# EAGLE design vca-op1 (EAGLE 6.6.0)
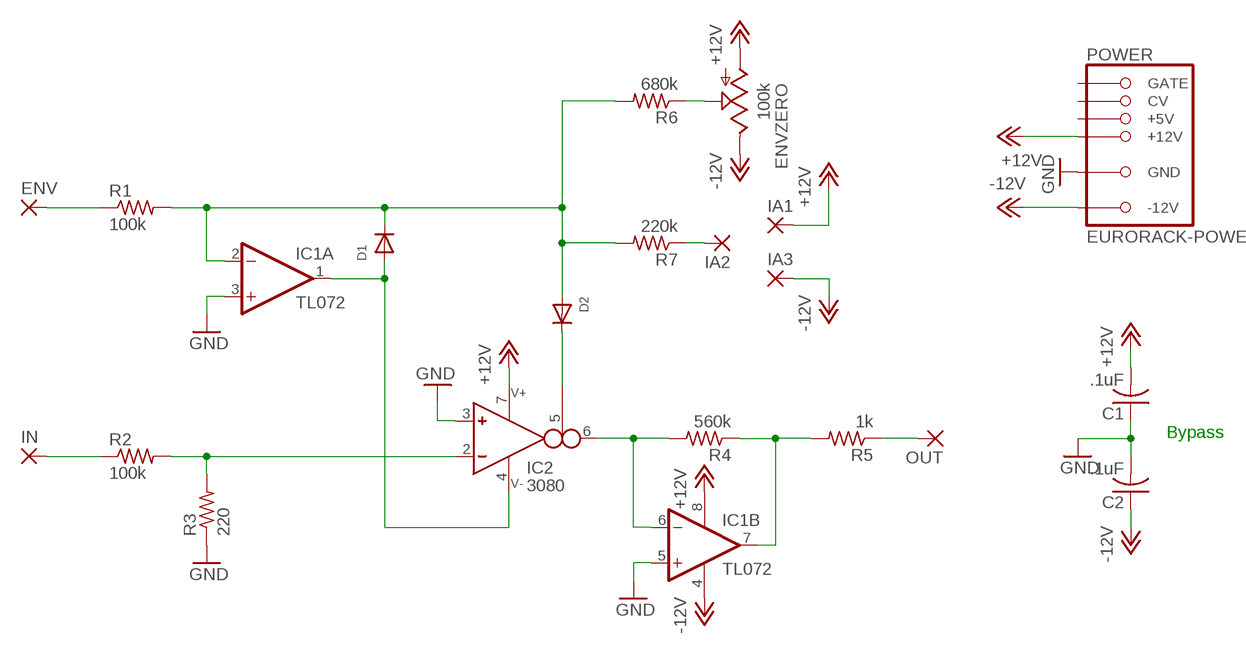
[diagram p0: schematic, sheet 1]

## Parts
C1  .1uF  C-US050-025X075  [C050-025X075]
C2  .1uF  C-US050-025X075  [C050-025X075]
D1  DIODEDO-1N4148  [DO-1N4148]
D2  DIODEDO-1N4148  [DO-1N4148]
ENV  2,54/1,0  [2,54/1,0]
ENVZERO  100k  TRIM_US-RJ9W  [RJ9W]
IA1  2,54/1,0  [2,54/1,0]
IA2  2,54/1,0  [2,54/1,0]
IA3  2,54/1,0  [2,54/1,0]
IC1  TL072  TL072-TOPP  [DIL08]
IC2  3080  CA3080E  [DIL08]
IN  2,54/1,0  [2,54/1,0]
OUT  2,54/1,0  [2,54/1,0]
POWER  EURORACK-POWER  [PINSHRD_PTH_2X8]
R1  100k  R-US_0207/10  [0207/10]
R2  100k  R-US_0207/10  [0207/10]
R3  220  R-US_0207/10  [0207/10]
R4  560k  R-US_0207/10  [0207/10]
R5  1k  R-US_0207/10  [0207/10]
R6  680k  R-US_0207/10  [0207/10]
R7  220k  R-US_0207/10  [0207/10]

## Nets
+12V: C1.2 ENVZERO.A IA1.1(P) IC1.8(P:V+) IC2.7(V+) POWER.+12V@1(+12V) POWER.+12V@2(+12V)
-12V: C2.1 ENVZERO.E IA3.1(P) IC1.4(P:V-) POWER.-12V@1(-12V) POWER.-12V@2(-12V)
GND: C1.1 C2.2 IC1.3(A:+IN) IC1.5(B:+IN) IC2.3(IN_P) POWER.GND@1(GND) POWER.GND@2(GND) POWER.GND@3(GND) POWER.GND@4(GND) POWER.GND@5(GND) POWER.GND@6(GND) R3.1
N$1: D1.C D2.A IC1.2(A:-IN) R1.2 R6.2 R7.2
N$2: ENV.1(P) R1.1
N$3: D2.C IC2.5(I_BIAS)
N$4: IN.1(P) R2.1
N$5: IC2.2(IN_N) R2.2 R3.2
N$6: ENVZERO.S R6.1
N$7: IC1.6(B:-IN) IC2.6(OUT) R4.2
N$8: IC1.7(B:OUT) R4.1 R5.2
N$9: OUT.1(P) R5.1
N$10: IA2.1(P) R7.1
V-: D1.A IC1.1(A:OUT) IC2.4(V-)
Unconnected: POWER.+5V@1(+5V) POWER.+5V@2(+5V) POWER.CV@1(CV) POWER.CV@2(CV) POWER.GATE@1(GATE) POWER.GATE@2(GATE)

## Notes on the sheet
- Bypass

## Library data of the parts
C1 C2 = rcl:C-US: CAPACITOR, American symbol
D1 D2 = mmoretti:DIODE: Diode SMADIODE - SMA Surface Mount Package 20V 1A Schottky Diode Digikey: 641-1014-6-ND DO-1N4148 - Through Hole Small Current Diode SOD-123 20V 1 A (.5mV Vf) Schottky Diode - Digikey: MBRX120TPMSCT-ND SOD-323 10V 570mA (.38mV Vf, 3ns) Schottky Diode - Digikey: ZLLS410CT-ND SOD-523 30V 30mA Schottky Diode (RB751S-40TE61) - Digikey: RB751S-40TE61CT-ND SOT23-R/W - SOT23 Package (R = Solder Paste/Reflow Ovens, W = Hand-Soldering) BAT54Film 40V 300mA - Digikey: 497-7162-1-ND
ENV IA1-IA3 IN OUT = wirepad:2,54/1,0: THROUGH-HOLE PAD
ENVZERO = pot:TRIM_US-: POTENTIOMETER
IC1 = mmoretti:TL072-TOP: OP AMP
IC2 = ota:CA3080: OTA
POWER = mmoretti:EURORACK-POWER
R1-R7 = rcl:R-US_: RESISTOR, American symbol

## Board
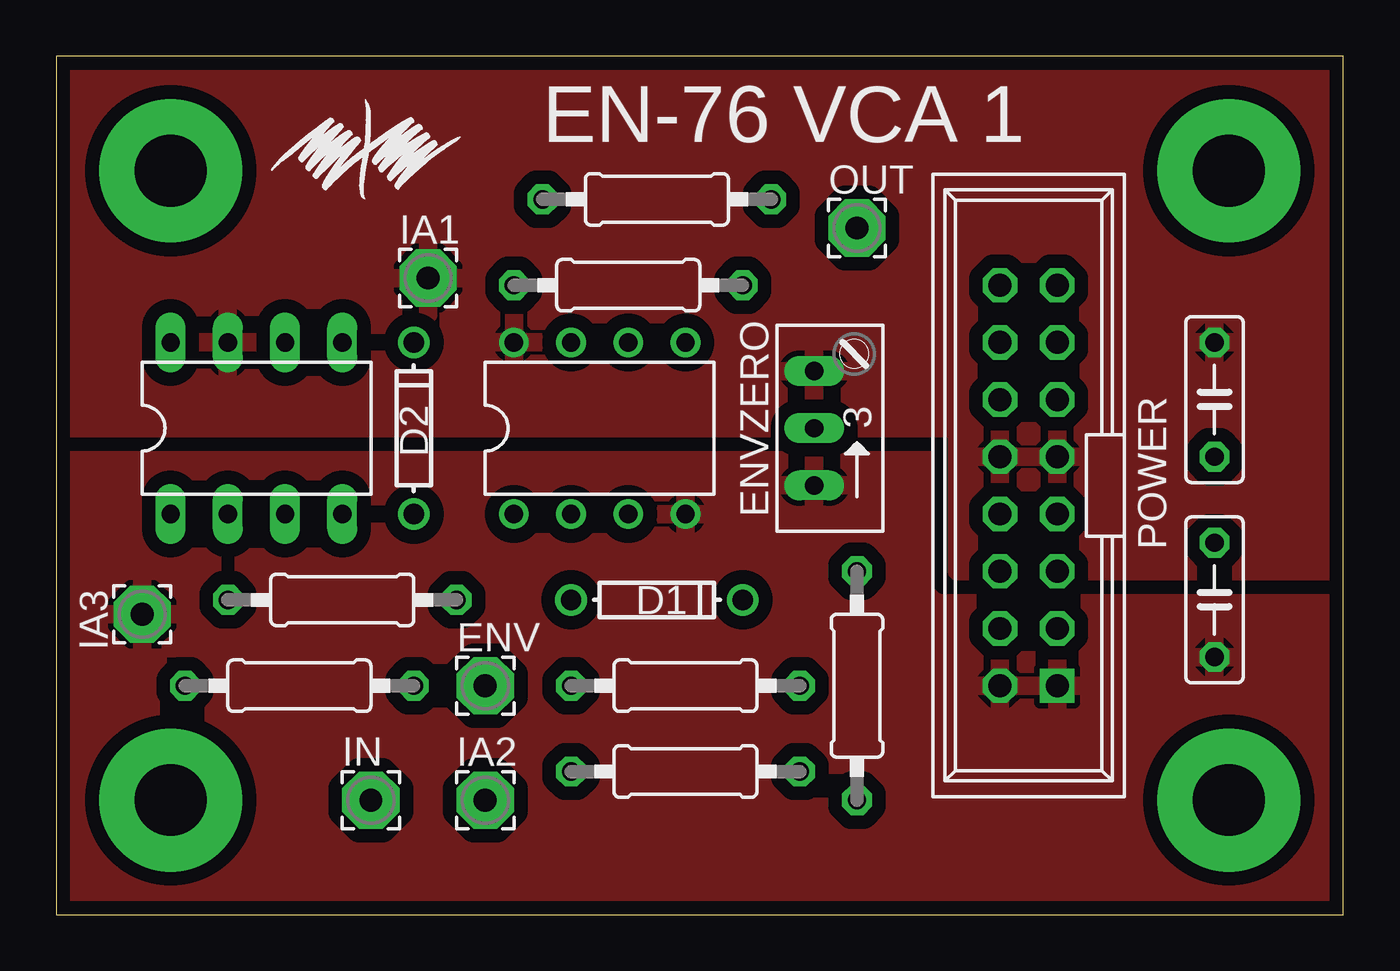
[diagram p1: board, top side]
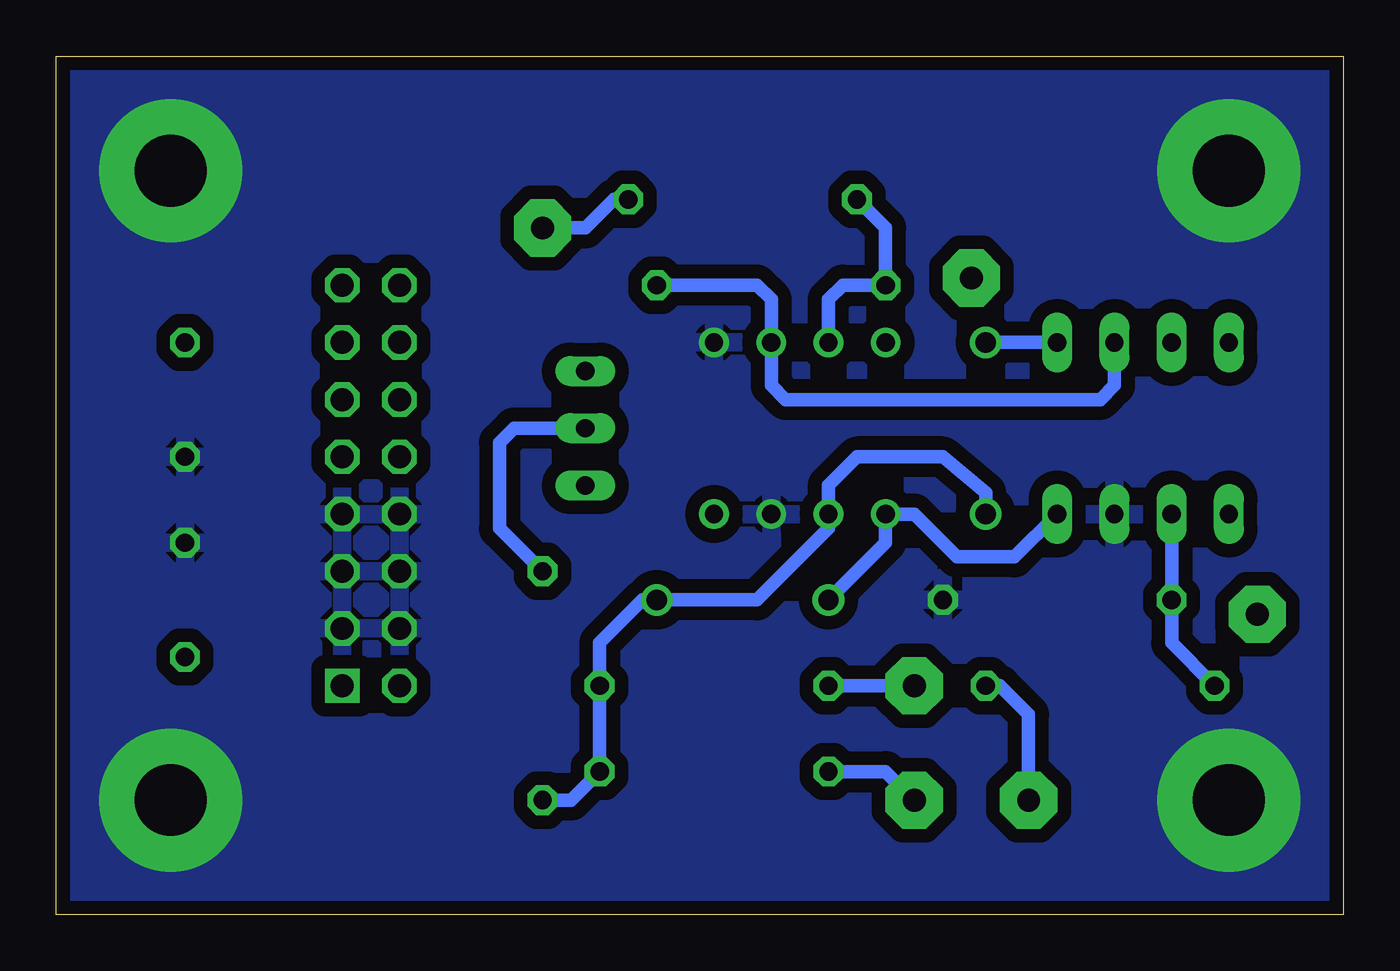
[diagram p2: board, bottom side, seen from below]

Size 57.15 x 38.1 mm. Coordinates in mm from the lower left corner, seen from the top.
Outline: 0,0 57.15,0 57.15,38.1 0,38.1 0,0
Copper layers (1*16): Top 0.035mm / dielectric 1.5mm / Bottom 0.035mm
Design rules "SeeedStudio_2layer_DRU_no_angle_20140221": minimum track width 6mil, minimum drill 12mil, track to track 6mil, track to pad 6mil, pad to pad 6mil, via to via 6mil, smd to smd 0mil, copper to edge 10mil, drill to drill 10mil, minimum pad ring 10mil, minimum via ring 6mil, stop-mask expansion 2mil, vias tented up to drill 100mil, thermal gap 10mil

### Footprints (pad centres in the part's own frame; a part is rotated, then mirrored left to right if it is on the bottom)
C050-025X075 = drill 0.813 octagon: 1 -2.54,0; 2 2.54,0
DO-1N4148 = drill 0.9: A -3.81,0; C 3.81,0
2,54/1,0 = drill 1.016 pad 2.54 octagon: 1 0,0
RJ9W = drill 0.813 long: A 2.54,0.635; E -2.54,0.635; S 0,0.635
DIL08 = drill 0.813 pad 1.27: 1 -3.81,-3.81; 2 -1.27,-3.81; 3 1.27,-3.81; 4 3.81,-3.81; 5 3.81,3.81; 6 1.27,3.81; 7 -1.27,3.81; 8 -3.81,3.81
DIL08' = drill 0.813 long: 1 -3.81,-3.81; 2 -1.27,-3.81; 3 1.27,-3.81; 4 3.81,-3.81; 5 3.81,3.81; 6 1.27,3.81; 7 -1.27,3.81; 8 -3.81,3.81
PINSHRD_PTH_2X8 = drill 1.016 octagon: +5V@1 3.81,1.27; +5V@2 3.81,-1.27; +12V@1 1.27,1.27; +12V@2 1.27,-1.27; -12V@1 -8.89,1.27; CV@1 6.35,1.27; CV@2 6.35,-1.27; GATE@1 8.89,1.27; GATE@2 8.89,-1.27; GND@1 -6.35,1.27; GND@2 -6.35,-1.27; GND@3 -3.81,1.27; GND@4 -3.81,-1.27; GND@5 -1.27,1.27; GND@6 -1.27,-1.27 | drill 1.016 square: -12V@2 -8.89,-1.27
0207/10 = drill 0.813 octagon: 1 -5.08,0; 2 5.08,0

### Placement (x,y rotation side)
C1  51.44,22.86 90 top
C2  51.44,13.97 90 top
D1  26.67,13.97 0 top
D2  15.88,21.59 90 top
ENV  19.05,10.16 0 top
ENVZERO  34.29,21.59 90 top
IA1  16.51,28.26 0 top
IA2  19.05,5.08 0 top
IA3  3.81,13.34 0 top
IC1  24.13,21.59 0 top
IC2  3080  [DIL08']  8.89,21.59 0 top
IN  13.97,5.08 0 top
OUT  35.56,30.48 0 top
POWER  43.18,19.05 90 top
R1  27.94,10.16 0 top
R2  10.79,10.16 180 top
R3  12.7,13.97 180 top
R4  25.4,27.94 0 top
R5  26.67,31.75 180 top
R6  35.56,10.16 270 top
R7  27.94,6.35 0 top

### Tracks (layer width: path | path; a pad name or v marks a point on that pad's centre or on a via)
+12V
  pour Top (isolate 0.61): 0,21.59 40.01,21.59 40.01,15.24 57.15,15.24 57.15,38.1 0,38.1
-12V
  pour Top (isolate 0.61, rank 2): 57.15,15.24 57.15,0 0,0 0,21.59 40.01,21.59 40.01,15.24
GND  (via drill 3.17 pad 6.35)
  other vias: 52.07,5.08 52.07,33.02 5.08,5.08 5.08,33.02
  pour Bottom (isolate 0.61): 0,38.1 57.15,38.1 57.15,0 0,0
N$1
  Bottom 0.61: D2.A 15.88,18.73 17.78,20.32 21.59,20.32 22.86,19.05 IC1.2 22.86,17.14 26.04,13.97 D1.C 31.11,13.97 33.02,12.06 R1.2 R7.2 34.29,5.08 R6.2
N$2
  Bottom 0.61: R1.1 ENV.1
N$3
  Bottom 0.61: IC2.5 D2.C
N$4
  Bottom 0.61: IN.1 13.97,8.89 15.24,10.16 R2.1
N$5
  Bottom 0.61: IC2.2 R3.2 7.62,12.06 R2.2
N$6
  Bottom 0.61: ENVZERO.S 36.83,21.59 37.47,20.95 37.47,17.14 R6.1
N$7
  Bottom 0.61: IC2.6 10.16,23.5 10.79,22.86 24.77,22.86 25.4,23.5 IC1.6 25.4,27.3 26.04,27.94 R4.2
N$8
  Bottom 0.61: R5.2 20.32,30.48 R4.1 22.23,27.94 22.86,27.3 IC1.7
N$9
  Bottom 0.61: R5.1 32.38,31.75 33.66,30.48 OUT.1
N$10
  Bottom 0.61: R7.1 20.32,6.35 IA2.1
V-
  Bottom 0.61: IC2.4 14.61,15.88 17.14,15.88 19.05,17.78 IC1.1 20.32,16.51 D1.A

### Text on the board
tPlace: EN-76 VCA 1